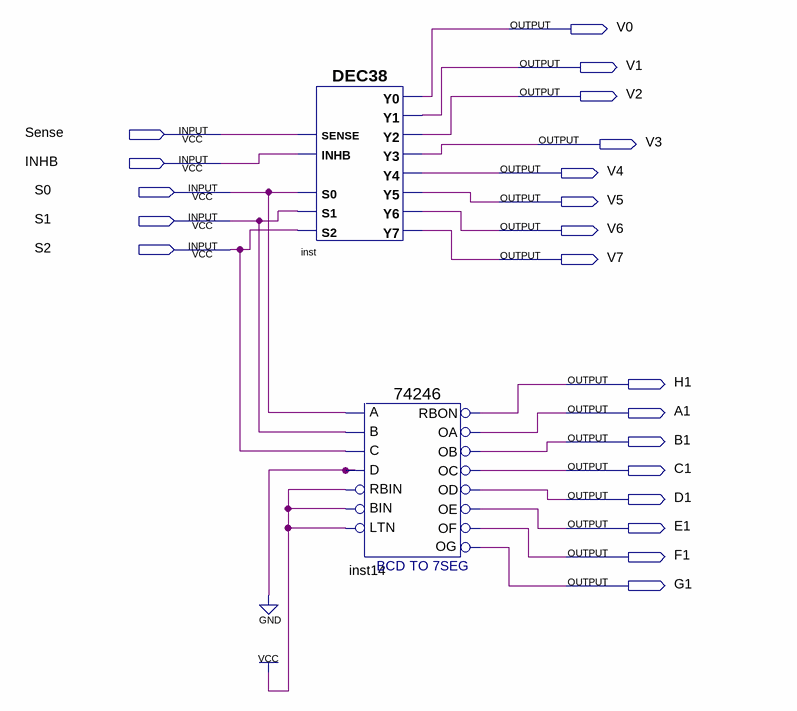
[diagram p0: schematic sheet]
// Quartus schematic P24.bdf as structural Verilog: 2 symbols, 21 pins
module P24 (
  input  Sense,
  input  INHB,
  input  S0,
  input  S1,
  input  S2,
  output V0,
  output V1,
  output V2,
  output V3,
  output V4,
  output V5,
  output V6,
  output V7,
  output H1,
  output A1,
  output B1,
  output C1,
  output D1,
  output E1,
  output F1,
  output G1
);

  DEC38 inst (
    .S2(S2), .S1(S1), .INHB(INHB), .S0(S0), .SENSE(Sense), .Y7(V7), .Y6(V6), .Y5(V5), .Y3(V3), .Y4(V4),
    .Y0(V0), .Y1(V1), .Y2(V2));
  \74246  inst14 (
    .B(S1), .A(S0), .RBIN(1'b1), .D(1'b0), .C(S2), .LTN(1'b1), .BIN(1'b1), .OD(D1), .RBON(H1), .OC(C1),
    .OB(B1), .OE(E1), .OF(F1), .OA(A1), .OG(G1));
endmodule
